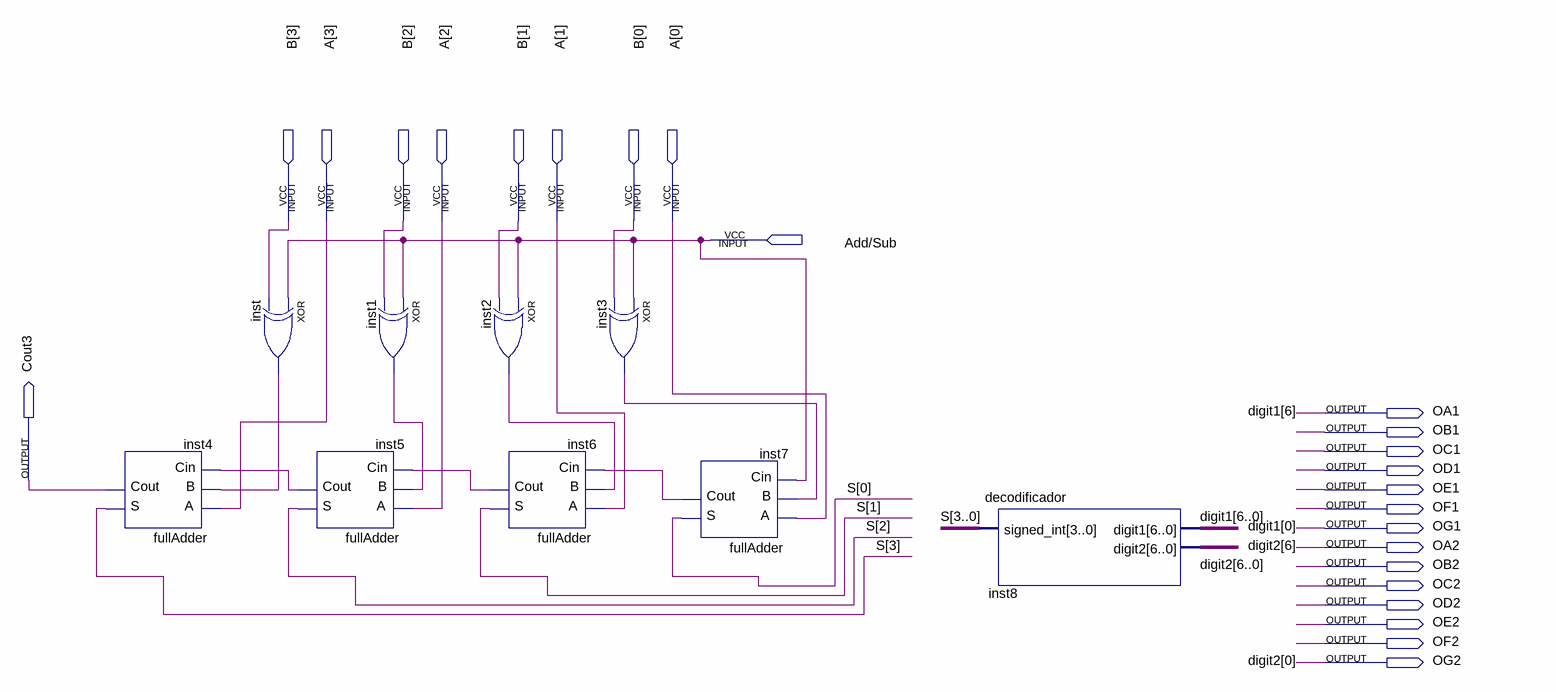
[diagram p0: schematic sheet]
// Quartus schematic somador4Bits.bdf as structural Verilog: 9 symbols, 24 pins
module somador4Bits (
  input  [3:0] B,
  input  [3:0] A,
  input  \Add/Sub ,
  output OA1,
  output OB1,
  output OC1,
  output OD1,
  output Cout3,
  output OE1,
  output OF1,
  output OG1,
  output OA2,
  output OB2,
  output OC2,
  output OD2,
  output OE2,
  output OF2,
  output OG2
);

  wire inst1_out, inst2_out, inst3_out, inst5_cout, inst6_cout, inst7_cout, inst_out;
  wire [3:0] S;

  fullAdder inst4 (.A(A[3]), .B(inst_out), .Cin(inst5_cout), .S(S[3]), .Cout(Cout3));
  xor inst (inst_out, \Add/Sub , B[3]);
  fullAdder inst5 (.A(A[2]), .B(inst1_out), .Cin(inst6_cout), .S(S[2]), .Cout(inst5_cout));
  xor inst1 (inst1_out, \Add/Sub , B[2]);
  xor inst2 (inst2_out, \Add/Sub , B[1]);
  fullAdder inst6 (.A(A[1]), .B(inst2_out), .Cin(inst7_cout), .S(S[1]), .Cout(inst6_cout));
  xor inst3 (inst3_out, \Add/Sub , B[0]);
  fullAdder inst7 (.A(A[0]), .B(inst3_out), .Cin(\Add/Sub ), .S(S[0]), .Cout(inst7_cout));
  decodificador inst8 (
    .signed_int(S), .digit1({OA1, OB1, OC1, OD1, OE1, OF1, OG1}), .digit2({OA2, OB2, OC2, OD2, OE2, OF2, OG2}));

  // Other names for the same wires on the sheet: digit1[6:0] = {OA1, OB1, OC1, OD1, OE1, OF1, OG1};
  //   digit2[6:0] = {OA2, OB2, OC2, OD2, OE2, OF2, OG2}
endmodule
